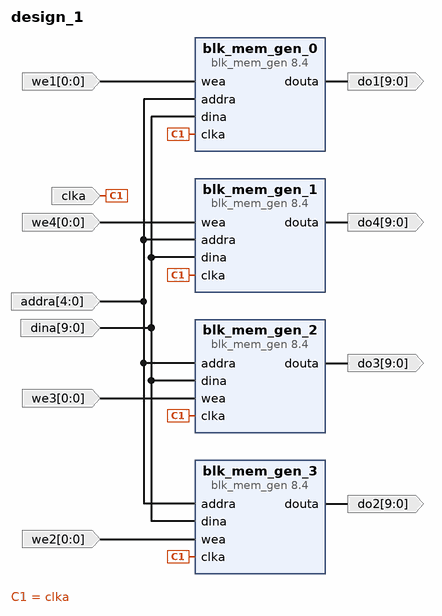
[diagram p0: block diagram of the top level]
# Vivado block design design_1, xc7a35tcpg236-1, Vivado 2017.4
create_bd_design design_1

create_bd_port -dir I -type clk clka
create_bd_port -dir I -from 9 -to 0 dina
create_bd_port -dir O -from 9 -to 0 do2
create_bd_port -dir O -from 9 -to 0 do3
create_bd_port -dir O -from 9 -to 0 do4
create_bd_port -dir O -from 9 -to 0 do1
create_bd_port -dir I -from 0 -to 0 we2
create_bd_port -dir I -from 0 -to 0 we3
create_bd_port -dir I -from 0 -to 0 we4
create_bd_port -dir I -from 0 -to 0 we1
create_bd_port -dir I -from 4 -to 0 addra

create_bd_cell -type ip -vlnv xilinx.com:ip:blk_mem_gen:8.4 blk_mem_gen_0
set_property -dict [list \
  CONFIG.Enable_32bit_Address false \
  CONFIG.Use_Byte_Write_Enable false \
  CONFIG.Write_Width_A 10 \
  CONFIG.Write_Depth_A 32 \
  CONFIG.Read_Width_A 10 \
  CONFIG.Enable_A Always_Enabled \
  CONFIG.Register_PortA_Output_of_Memory_Primitives true \
  CONFIG.Use_RSTA_Pin false \
  CONFIG.use_bram_block Stand_Alone \
] [get_bd_cells blk_mem_gen_0]
create_bd_cell -type ip -vlnv xilinx.com:ip:blk_mem_gen:8.4 blk_mem_gen_1
set_property -dict [list \
  CONFIG.Enable_32bit_Address false \
  CONFIG.Use_Byte_Write_Enable false \
  CONFIG.Write_Width_A 10 \
  CONFIG.Write_Depth_A 32 \
  CONFIG.Read_Width_A 10 \
  CONFIG.Enable_A Always_Enabled \
  CONFIG.Register_PortA_Output_of_Memory_Primitives true \
  CONFIG.Use_RSTA_Pin false \
  CONFIG.use_bram_block Stand_Alone \
] [get_bd_cells blk_mem_gen_1]
create_bd_cell -type ip -vlnv xilinx.com:ip:blk_mem_gen:8.4 blk_mem_gen_2
set_property -dict [list \
  CONFIG.Enable_32bit_Address false \
  CONFIG.Use_Byte_Write_Enable false \
  CONFIG.Write_Width_A 10 \
  CONFIG.Write_Depth_A 32 \
  CONFIG.Read_Width_A 10 \
  CONFIG.Enable_A Always_Enabled \
  CONFIG.Register_PortA_Output_of_Memory_Primitives true \
  CONFIG.Use_RSTA_Pin false \
  CONFIG.use_bram_block Stand_Alone \
] [get_bd_cells blk_mem_gen_2]
create_bd_cell -type ip -vlnv xilinx.com:ip:blk_mem_gen:8.4 blk_mem_gen_3
set_property -dict [list \
  CONFIG.Enable_32bit_Address false \
  CONFIG.Use_Byte_Write_Enable false \
  CONFIG.Write_Width_A 10 \
  CONFIG.Write_Depth_A 32 \
  CONFIG.Read_Width_A 10 \
  CONFIG.Enable_A Always_Enabled \
  CONFIG.Register_PortA_Output_of_Memory_Primitives true \
  CONFIG.Use_RSTA_Pin false \
  CONFIG.use_bram_block Stand_Alone \
] [get_bd_cells blk_mem_gen_3]

# ---- connections ----

connect_bd_net [get_bd_ports addra] \
  [get_bd_pins blk_mem_gen_0/addra] [get_bd_pins blk_mem_gen_1/addra] [get_bd_pins blk_mem_gen_2/addra] \
  [get_bd_pins blk_mem_gen_3/addra]
connect_bd_net [get_bd_ports clka] \
  [get_bd_pins blk_mem_gen_0/clka] [get_bd_pins blk_mem_gen_1/clka] [get_bd_pins blk_mem_gen_2/clka] \
  [get_bd_pins blk_mem_gen_3/clka]
connect_bd_net [get_bd_pins blk_mem_gen_3/douta] [get_bd_ports do2]
connect_bd_net [get_bd_pins blk_mem_gen_2/douta] [get_bd_ports do3]
connect_bd_net [get_bd_pins blk_mem_gen_1/douta] [get_bd_ports do4]
connect_bd_net [get_bd_pins blk_mem_gen_0/douta] [get_bd_ports do1]
connect_bd_net -net we2_1 [get_bd_ports we2] [get_bd_pins blk_mem_gen_3/wea]
connect_bd_net -net we3_1 [get_bd_ports we3] [get_bd_pins blk_mem_gen_2/wea]
connect_bd_net -net we4_1 [get_bd_ports we4] [get_bd_pins blk_mem_gen_1/wea]
connect_bd_net -net wea_1 [get_bd_ports we1] [get_bd_pins blk_mem_gen_0/wea]
connect_bd_net [get_bd_ports dina] \
  [get_bd_pins blk_mem_gen_0/dina] [get_bd_pins blk_mem_gen_3/dina] [get_bd_pins blk_mem_gen_2/dina] \
  [get_bd_pins blk_mem_gen_1/dina]

validate_bd_design
save_bd_design
